# EAGLE design BPMLabLineRX2 (EAGLE 7.5.0)
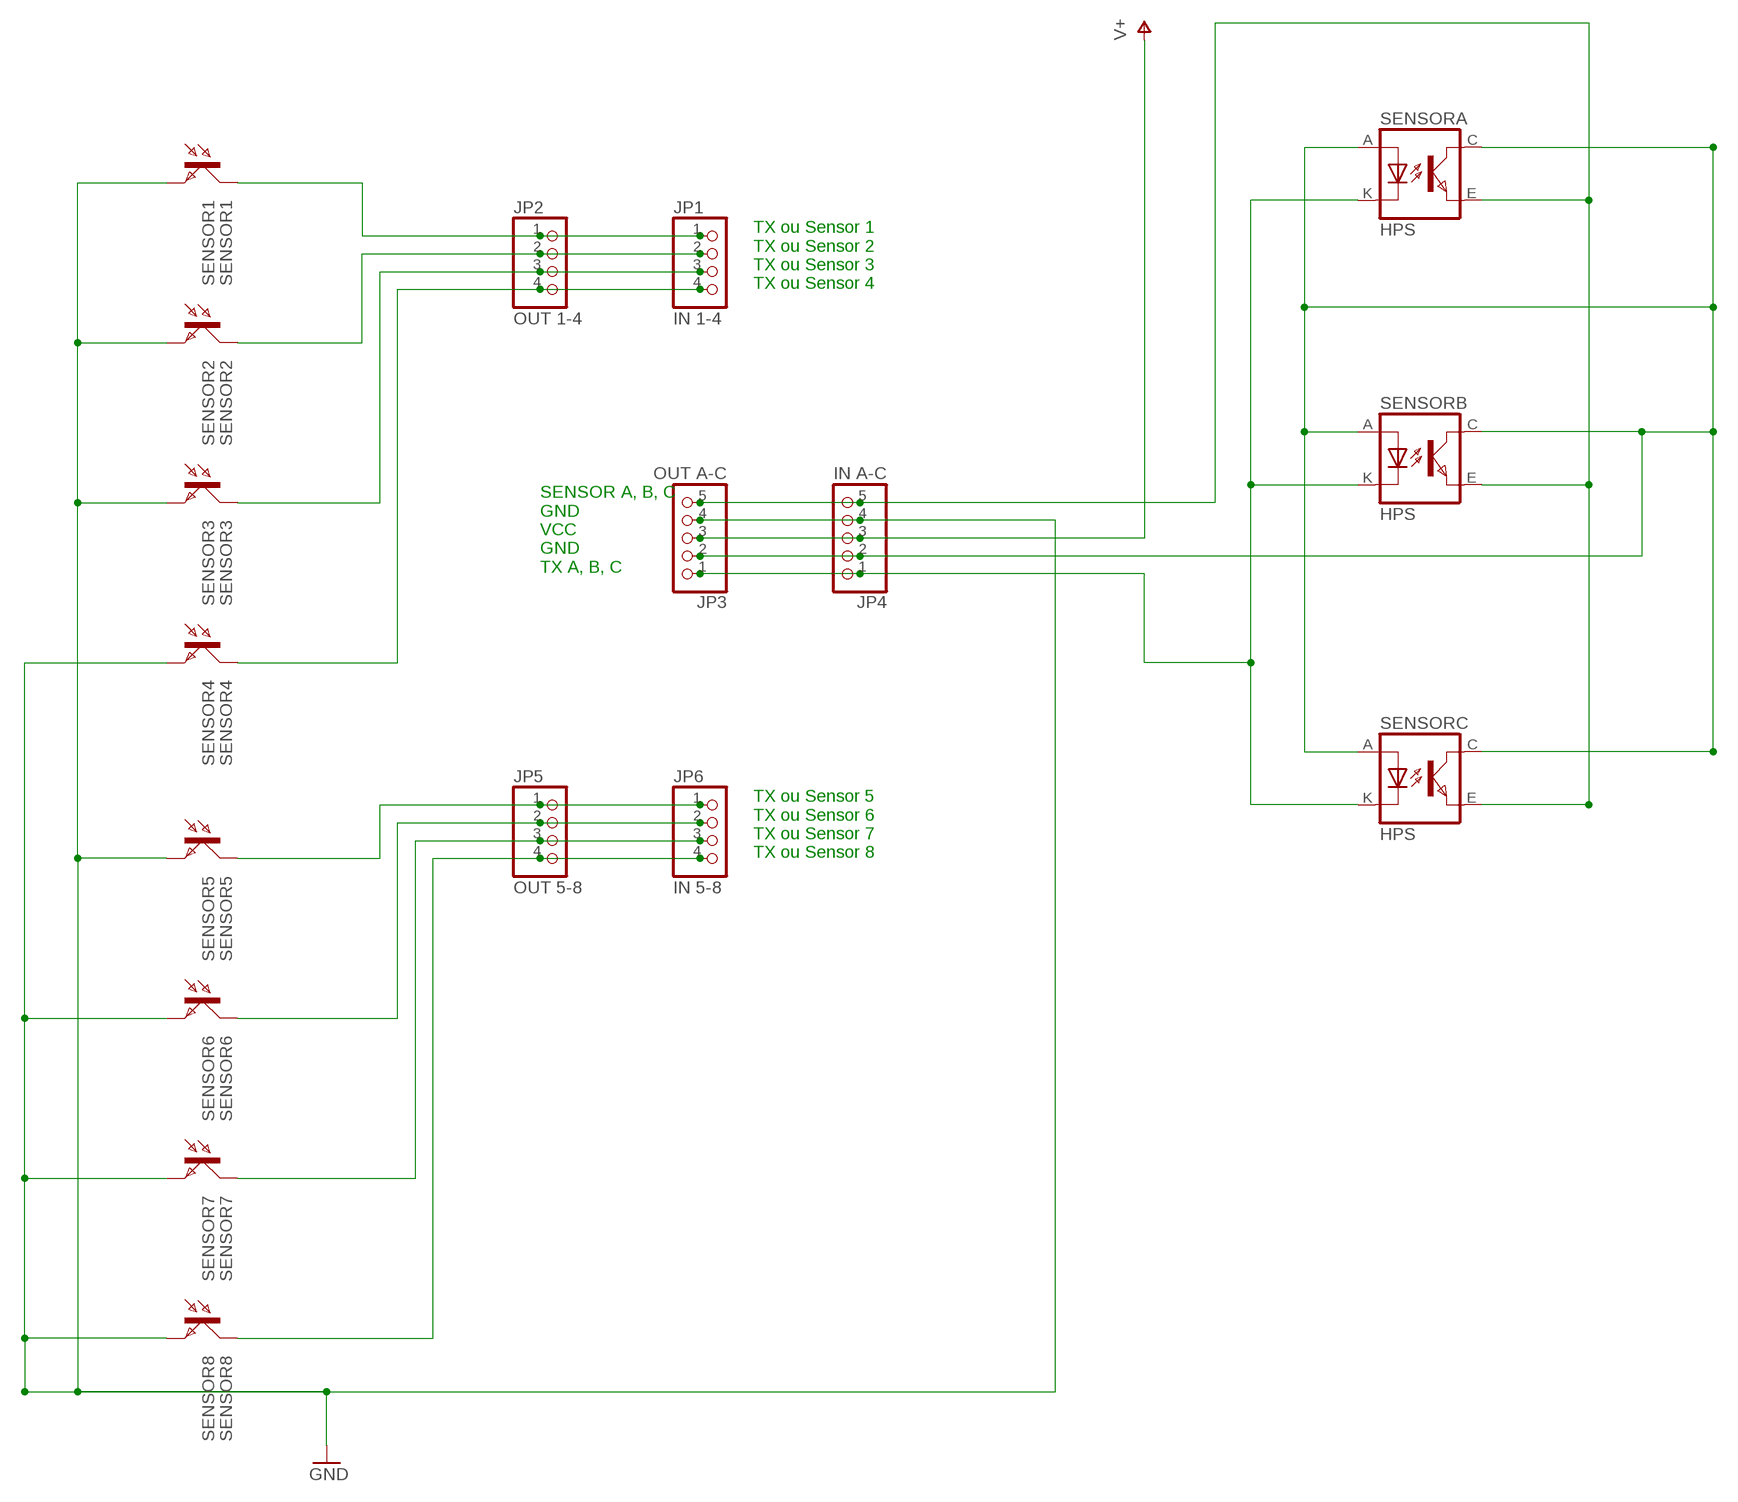
[diagram p0: schematic, sheet 1]

## Parts
JP1  IN 1-4  PINHD-1X4  [1X04]
JP2  OUT 1-4  PINHD-1X4  [1X04]
JP3  OUT A-C  PINHD-1X5  [1X05]
JP4  IN A-C  PINHD-1X5  [1X05]
JP5  OUT 5-8  PINHD-1X4  [1X04]
JP6  IN 5-8  PINHD-1X4  [1X04]
SENSOR1  SENSOR1  BPX81  [BPX81]
SENSOR2  SENSOR2  BPX81  [BPX81]
SENSOR3  SENSOR3  BPX81  [BPX81]
SENSOR4  SENSOR4  BPX81  [BPX81]
SENSOR5  SENSOR5  BPX81  [BPX81]
SENSOR6  SENSOR6  BPX81  [BPX81]
SENSOR7  SENSOR7  BPX81  [BPX81]
SENSOR8  SENSOR8  BPX81  [BPX81]
SENSORA  HPS  TCRT5000  [TCRT5000]
SENSORB  HPS  TCRT5000  [TCRT5000]
SENSORC  HPS  TCRT5000  [TCRT5000]

## Nets
GND: JP3.4 JP4.4 SENSOR1.E SENSOR2.E SENSOR3.E SENSOR4.E SENSOR5.E SENSOR6.E SENSOR7.E SENSOR8.E
N$1: JP1.4 JP2.4 SENSOR4.C
N$2: JP5.2 JP6.2 SENSOR6.C
N$3: JP5.3 JP6.3 SENSOR7.C
N$4: JP5.4 JP6.4 SENSOR8.C
N$5: JP1.1 JP2.1 SENSOR1.C
N$6: JP1.2 JP2.2 SENSOR2.C
N$7: JP1.3 JP2.3 SENSOR3.C
N$8: JP5.1 JP6.1 SENSOR5.C
N$9: JP3.5 JP4.5 SENSORA.E(EMITTER) SENSORB.E(EMITTER) SENSORC.E(EMITTER)
N$10: JP3.1 JP4.1 SENSORA.K(CATHODE) SENSORB.K(CATHODE) SENSORC.K(CATHODE)
N$16: JP3.2 JP4.2 SENSORA.A(ANODE) SENSORA.C(COLLECTOR) SENSORB.A(ANODE) SENSORB.C(COLLECTOR) SENSORC.A(ANODE) SENSORC.C(COLLECTOR)
V+: JP3.3 JP4.3

## Notes on the sheet
- TX ou Sensor 1
  TX ou Sensor 2
  TX ou Sensor 3
  TX ou Sensor 4
- SENSOR A, B, C
  GND
  VCC
  GND
  TX A, B, C
- TX ou Sensor 5
  TX ou Sensor 6
  TX ou Sensor 7
  TX ou Sensor 8

## Library data of the parts
JP1 JP2 JP5 JP6 = pinhead:PINHD-1X4: PIN HEADER
JP3 JP4 = pinhead:PINHD-1X5: PIN HEADER
SENSOR1-SENSOR8 = opto-trans-siemens:BPX81: PHOTO TRANSISTOR; OC_FARNELL: unknown; OC_NEWARK: unknown
SENSORA SENSORB SENSORC = tcrt5000:TCRT5000

## Board
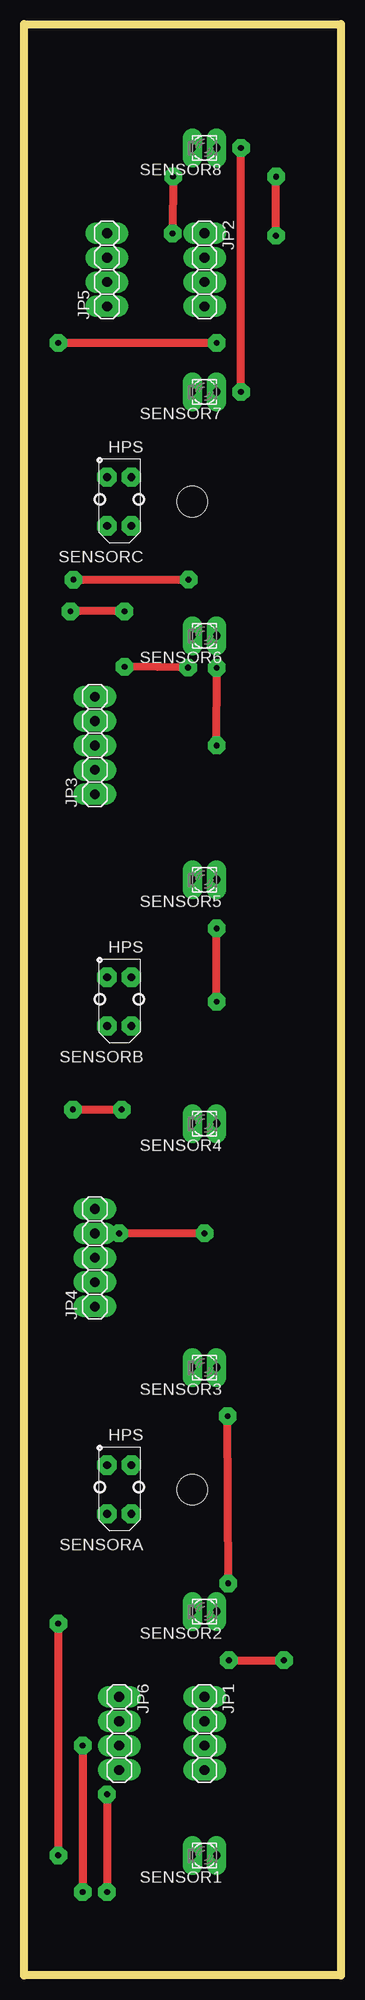
[diagram p1: board, top side]
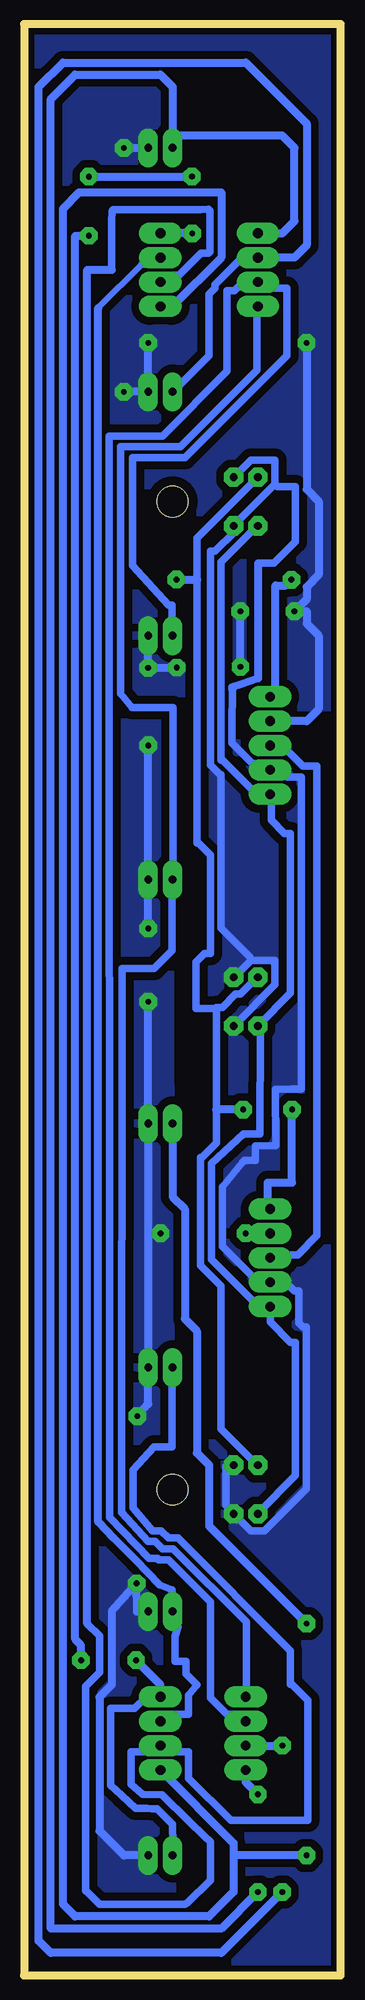
[diagram p2: board, bottom side, seen from below]

Size 33.04 x 203.2 mm. Coordinates in mm from the lower left corner, seen from the top.
Outline: 33.04,203.18 33.04,0 0.02,0 0,203.18 33.04,203.18
Outline: 33.04,203.18 25.42,203.2
Copper layers (1*16): Top 0.035mm / dielectric 1.5mm / Bottom 0.035mm
Design rules "botpcb *": minimum track width 0.6mm, minimum drill 0.6mm, track to track 0.3mm, track to pad 0.3mm, pad to pad 0.3mm, via to via 0.3mm, smd to smd 8mil, copper to edge 40mil, drill to drill 8mil, minimum pad ring 24mil, minimum via ring 24mil, stop-mask expansion 0mil, vias tented up to drill 0mil, thermal gap 0mil
Holes 3.2 mm at 17.55,50.6 17.55,153.47
Milling: 4 lines

### Footprints (pad centres in the part's own frame; a part is rotated, then mirrored left to right if it is on the bottom)
1X04 = drill 1.016 long: 1 -3.81,0; 2 -1.27,0; 3 1.27,0; 4 3.81,0
1X05 = drill 1.016 long: 1 -5.08,0; 2 -2.54,0; 3 0,0; 4 2.54,0; 5 5.08,0
BPX81 = drill 0.813 long: C 1.27,0; E -1.27,0
TCRT5000 = drill 0.8 octagon: A -2.54,-1.27; C 2.54,-1.27; E 2.54,1.27; K -2.54,1.27

### Placement (x,y rotation side)
JP1  18.82,25.2 270 top
JP2  18.82,177.6 270 top
JP3  7.39,128.07 90 top
JP4  7.39,74.73 90 top
JP5  8.66,177.6 90 top
JP6  9.93,25.2 270 top
SENSOR1  18.82,12.5 180 top
SENSOR2  18.82,37.9 180 top
SENSOR3  18.82,63.3 180 top
SENSOR4  18.82,88.7 180 top
SENSOR5  18.82,114.1 180 top
SENSOR6  18.82,139.5 180 top
SENSOR7  18.82,164.9 180 top
SENSOR8  18.82,190.3 180 top
SENSORA  9.93,50.6 90 top
SENSORB  9.93,101.4 90 top
SENSORC  9.93,153.47 90 top

### Tracks (layer width: path | path; a pad name or v marks a point on that pad's centre or on a via)
GND  (via drill 0.6)
  Top 0.813: v22.63,164.9 v22.63,190.3 | v18.82,77.27 v9.93,77.27 | v20.09,101.4 v20.09,109.02 | v20.09,128.07 v20.1,136.17 | v17.11,136.19 v10.48,136.28 | v10.48,142.06 v4.85,142.04 | v20.09,169.98 v3.58,169.98 | v21.3,40.83 v21.23,58.24
  Bottom 0.813: v22.63,164.9 SENSOR7.E v20.09,169.98 | v22.63,190.3 SENSOR8.E | SENSOR1.E 22.63,12.5 25.17,15.04 25.17,29.01 23.9,30.28 23.9,37.9 v21.3,40.83 21.28,37.9 SENSOR2.E | 20.09,77.27 SENSOR3.E 20.09,59.49 v21.23,58.24 | 20.09,77.27 SENSOR4.E v20.09,101.4 | 20.09,77.27 v18.82,77.27 | v9.93,77.27 JP4.4 | v20.09,109.02 SENSOR5.E v20.09,128.07 | SENSOR6.E v20.1,136.17 v17.11,136.19 | v10.48,136.28 v10.48,142.06 | JP3.4 3.58,130.61 2.31,131.88 2.31,139.5 3.58,140.77 3.58,142.04 v4.85,142.04 3.58,143.31 3.58,144.58 2.31,145.85 2.31,153.47 3.58,154.74 v3.58,169.98
  pour Bottom (isolate 0.813): 17.55,1.07 17.8,132.08 1.04,132.08 1.04,201.73 31.77,201.93 31.77,1.27
N$1  (via drill 0.6)
  Top 0.813: v3.58,36.63 v3.58,12.5
  Bottom 0.813: JP1.4 11.2,13.77 11.2,12.5 | 11.2,12.5 11.2,8.69 13.74,6.15 27.71,6.15 28.98,7.42 28.98,183.95 27.29,185.68 12.47,185.68 12.47,178.87 17.55,173.79 JP2.4 | SENSOR4.C 17.55,81.08 16.28,79.81 16.28,68.38 15.01,67.11 15.01,54.41 13.74,53.14 13.74,46.79 v3.58,36.63 | v3.58,12.5 11.2,12.5
N$2
  Bottom 0.8: SENSOR6.C 17.62,139.55 17.62,142.68 18,142.68 21.72,146.8 21.72,158.05 16.25,158.05 5.62,168.68 5.62,175.68 6.87,175.68 7.5,176.3 8.62,176.3 JP5.2 9,176.18 10.37,176.18 11.12,175.43 11.87,175.43 11.87,167.05 18.62,160.3 24.17,160.3 24.13,47.7 20,43.43 19.12,43.43 19,43.3 18,43.3 13.62,38.93 13.62,28.93 11.87,27.18 10.62,27.18 10,26.55 JP6.2
N$3  (via drill 0.6)
  Top 0.813: v6.12,23.93 v6.12,8.69
  Bottom 0.8: SENSOR7.C 17.5,164.93 13.75,168.68 13.75,175.05 13.12,175.68 13.12,176.05 10.37,178.8 8.75,178.8 JP5.3
  Bottom 0.813: JP6.3 v6.12,23.93 | v6.12,8.69 12.47,2.34 30.25,2.34 31.52,3.61 31.52,196.65 28.98,199.19 9.93,199.19 3.58,192.84 3.58,180.14 4.85,178.87 JP5.3
N$4  (via drill 0.6)
  Top 0.813: v8.66,18.85 v8.66,8.69
  Bottom 0.813: JP6.4 9.93,20.12 v8.66,18.85 | v8.66,8.69 12.47,4.88 30.25,4.88 30.25,195.38 27.71,197.92 18.82,197.92 17.55,196.65 17.55,191.57 | 17.55,191.57 SENSOR8.C | JP5.4 6.12,181.41 4.85,182.68 4.85,190.3 6.12,191.57 17.55,191.57
N$5  (via drill 0.6)
  Top 0.813: v21.36,32.82 v27.09,32.82 | v26.27,181.16 v26.27,187.31 | v15.54,187.31 v15.49,181.4
  Bottom 0.8: SENSOR1.C 17.62,12.55 17.51,13.63 17.57,15.76 17.92,16.13 19.15,17.34 19.68,17.38 20.23,17.39 21.43,17.4 22.87,18.75 24,19.8 24,27.8 21.5,27.8 20.37,28.93 18.87,28.93 JP1.1
  Bottom 0.813: JP1.1 18.82,30.28 v21.36,32.82 | v27.09,32.82 27.09,34.36 27.7,35 27.71,180.14 27.7,181.15 v26.27,181.16 | v26.27,187.31 v15.54,187.31 | v15.49,181.4 15.83,181.41 JP2.1
N$6
  Bottom 0.61: 25.29,173.66 20.75,178.18 | 25.23,47.2 25.31,47.23
  Bottom 0.8: JP1.2 18.75,26.55 18.12,27.18 15.87,27.18 15.87,29.18 15.01,30.28 16.14,31.42 16.14,32.72 17.29,32.72 17.29,35.32 17,36.3 17.5,37.57 17.5,37.8 SENSOR2.C 17.62,38.3 17.62,40.18 18.89,40.68 21.42,43.28 22.41,44.27 23.7,45.56 | 20.75,178.18 19.5,178.18 18.87,178.8 JP2.2
  Bottom 0.813: 25.31,47.23 25.29,173.66 | 23.7,45.56 25.23,47.2
N$7
  Bottom 0.8: SENSOR3.C 17.62,63.3 17.62,55.05 19.5,55.05 21.67,52.64 21.67,48.67 19.62,46.3 18.75,46.3 18,45.55 17,45.55 5.25,33.8 5.25,30.3 5.12,30.3 3.48,28.66 3.48,16.16 11.48,16.16 15.87,20.55 15.87,23.3 18.12,23.3 18.75,23.93 JP1.3 18.62,23.3 21.87,23.3 21.87,20.68 21.88,19.9 20.66,18.85 18.64,18.81 15.84,16.03 14.2,14.47 13.62,13.91 13.62,9.93 16,7.55 16.28,7.42 25.17,7.42 26.44,8.69 26.57,8.78 26.62,8.82 26.62,30.1 25.17,31.55 25.17,35.36 26.44,36.63 | 23.9,177.6 23.9,182.68 23.87,183.71 23.74,183.85 14.64,183.88 13.82,183.93 13.65,183.76 13.65,179.49 13.82,179.32 14.6,179.32 16.87,177.05 18.12,177.05 18.75,176.43 JP2.3
  Bottom 0.813: 23.9,177.6 26.44,177.6 26.44,36.63
N$8
  Bottom 0.8: JP5.1 8.75,173.68 8.75,167.18 16.75,159.18 23,159.18 23,133.49 21.77,132.01 17.5,132.01 17.5,114.18 SENSOR5.C 17.62,113.8 17.62,106.72 19.5,104.85 22.79,104.85 22.86,48.23 20.12,45.18 19.37,45.18 18.62,44.43 17.5,44.43 9.87,36.8 9.87,29.05 JP6.1
N$9  (via drill 0.6)
  Top 0.813: v5.1,90.17 v10.18,90.17 | v5.16,145.34 17.13,145.34 v17.15,145.36
  Bottom 0.8: 13,100.68 13,100.8 12.37,100.8 11,102.18 10.5,102.18 8.75,103.93 SENSORB.E | 13,100.68 13,90.17 13,86.68 14.5,85.18 14.62,85.18 14.62,73.93 12.5,71.8 12.5,56.93 8.75,53.18 SENSORA.E | 13,100.68 15.12,100.68 15.12,105.55 14.25,106.43 13.62,106.43 13.62,116.68 14.87,117.93 15,117.93 15,145.34 15,149.68 8.75,155.93 SENSORC.E
  Bottom 0.813: JP4.5 7.64,79.81 7.64,82.55 5.1,82.55 v5.1,90.17 | v10.18,90.17 13,90.17 | JP3.5 6.83,133.18 6.83,144.73 5.76,144.73 v5.16,145.34 | v17.15,145.36 15.02,145.36 15,145.34
N$10
  Bottom 0.8: SENSORA.K 8.62,48.18 4.75,52.05 4.75,65.93 5.25,65.93 7.37,68.05 7.37,69.55 JP4.1 7.75,69.8 8.25,70.3 9.25,70.3 13.5,74.55 13.5,84.55 10.18,87.63 10.18,87.64 8.43,87.64 8.39,98.5 8.37,98.68 SENSORB.K 8.62,98.93 5.25,102.3 5.25,118.93 5.87,118.93 7.25,120.3 7.25,122.93 7.37,122.93 JP3.1 7.75,123.05 8.87,123.05 12.37,126.55 12.5,126.55 12.5,147.18 8.75,150.93 SENSORC.K
N$16
  Bottom 0.8: SENSORA.C 11.25,53.05 12,53.05 12,48.93 11.25,48.18 SENSORA.A 10.87,47.8 9.37,46.3 8,46.3 3.62,50.68 3.62,67.55 4,67.55 4.37,67.93 4.37,71.3 4.87,71.3 5.62,72.05 7,72.05 JP4.2 8,72.8 9.25,72.8 12.37,75.93 12.37,82.09 10.29,84.63 10.04,84.88 8.91,84.88 8.91,86.39 6.79,86.42 6.82,92.24 5.1,92.3 4.12,92.3 4.12,124.8 5.62,124.8 6.37,125.55 7,125.55 JP3.2 7.5,125.55 8.12,126.18 9.25,126.18 11.37,128.3 11.37,130.43 11.33,133.54 11.34,134.13 11.19,134.13 11.19,134.06 11.29,134.06 11.29,134.13 11.37,134.13 10.4,134.49 8.63,135.08 | 9.37,105.68 6.87,105.68 6.87,103.18 11.12,98.93 SENSORB.A | 9.37,105.68 11,104.05 11.12,104.05 SENSORB.C | 6.87,155.3 11.12,151.05 SENSORC.A 11.12,150.55 11.12,150.3 13.12,148.3 13.62,148.3 13.62,126.05 12.62,125.05 12.5,125.05 12.5,109.05 9.5,106.05 9.37,105.68 | 6.87,155.3 6.87,157.8 9.37,157.8 11.12,156.05 SENSORC.C | 8.62,147.06 7.5,147.05 7,147.05 4.75,149.3 4.75,155.05 6.62,155.05 6.87,155.3
  Bottom 0.813: 8.63,135.08 8.62,147.06
  pour Bottom (isolate 0.813): 1.29,1.27 1.29,128.27 15.26,128.27 15.26,1.27
V+
  Bottom 0.8: JP4.3 7.37,74.8 7.12,75.05 4.5,75.05 2.5,77.05 2.5,125.93 4,125.93 6.12,128.05 7.37,128.05 JP3.3